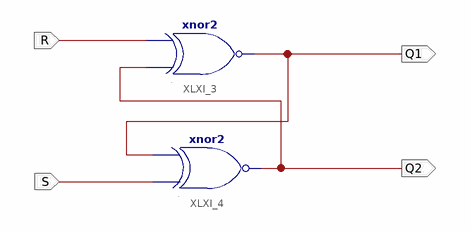
[diagram p0: schematic sheet 1]
// Xilinx ISE schematic lab7_experiment2.sch (spartan3e) as structural Verilog: 2 symbols, 4 ports
module lab7_experiment2 (
  input  R,
  input  S,
  output Q1,
  output Q2
);

  xnor XLXI_3 (Q1, Q2, R);
  xnor XLXI_4 (Q2, S, Q1);
endmodule
